# Altium schematic sheet top.SchDoc: CAN Shield k64F
size A; Author: Ramiro Merello; DrawnBy: Ramiro Merello; Revision: .revision; SheetNumber: 1; SheetTotal: 1
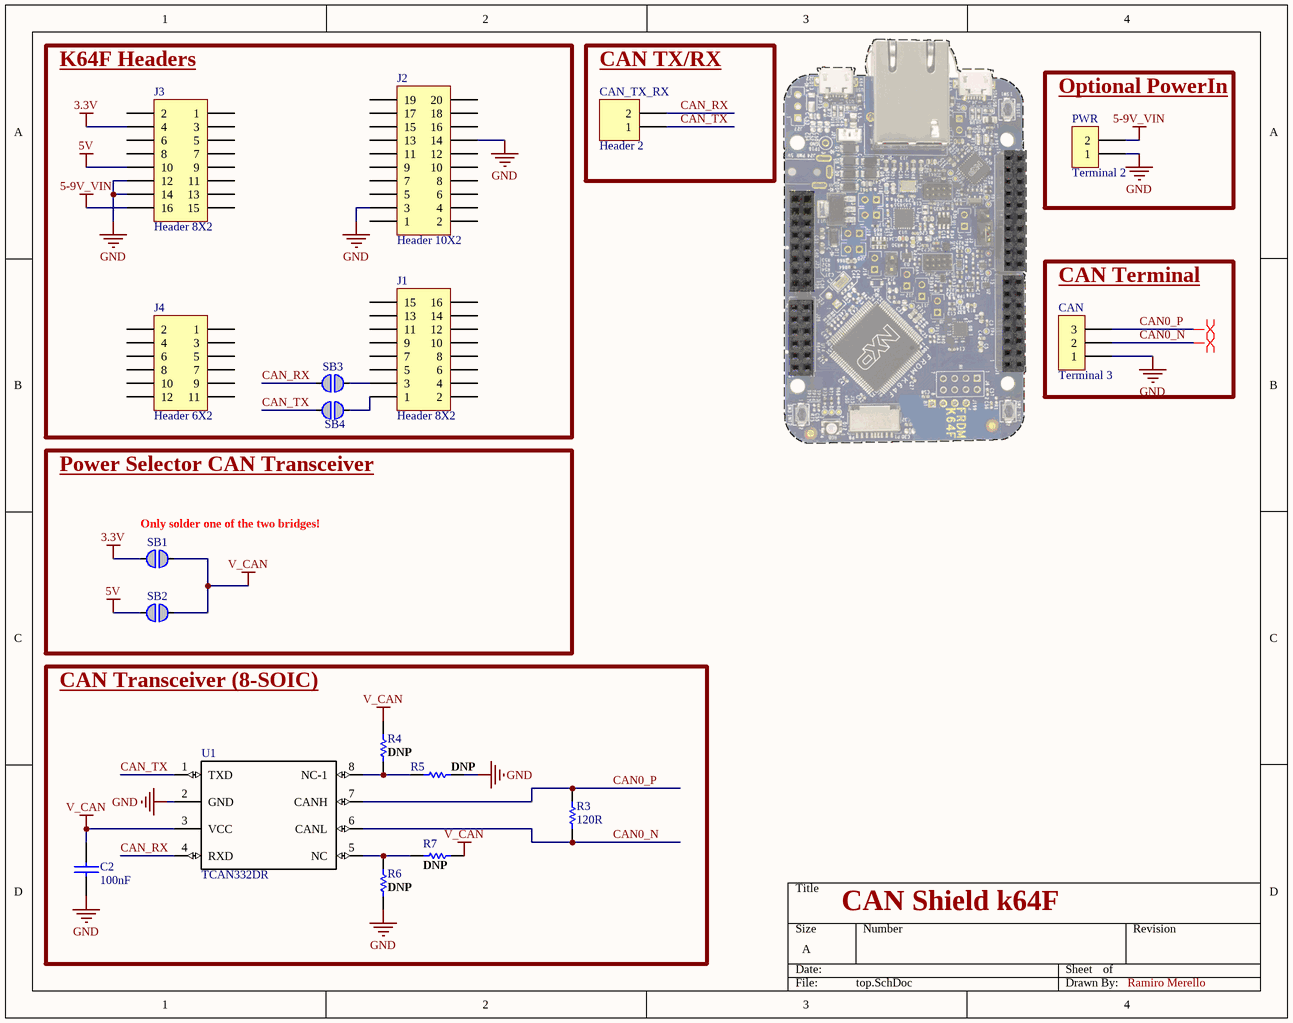
[diagram p0: top.SchDoc]

## Parts
C2  value 100nF  [0805]  (hidden comment: CDecoup)
CAN  Terminal 3  [BORNERA3]
CAN_TX_RX  Header 2  [HDR1X2]
J1  Header 8X2  [HDR2X8]
J2  Header 10X2  [HDR2X10]
J3  Header 8X2  [HDR2X8]
J4  Header 6X2  [HDR2X6]
PWR  Terminal 2  [BORNERA2]
R3  value 120R  [0805]  (hidden comment: RES)
R4  DNP  [0805]
R5  DNP  [0805]
R6  DNP  [0805]
R7  DNP  [0805]
SB1  Solderbridge  [Solderbridge]  (value not drawn)  (no BOM)
SB2  Solderbridge  [Solderbridge]  (value not drawn)  (no BOM)
SB3  Solderbridge  [Solderbridge]  (value not drawn)  (no BOM)
SB4  Solderbridge  [Solderbridge]  (value not drawn)  (no BOM)
U1  TCAN332DR  [SOIC127P600X175-8N]

## Blocks framed on the sheet
K64F Headers: J1-J4 SB3 SB4
CAN TX/RX: CAN_TX_RX
Optional PowerIn: PWR
CAN Terminal: CAN
Power Selector CAN Transceiver: SB1 SB2
CAN Transceiver (8-SOIC): C2 R3-R7 U1

## Nets
3.3V: J3.4 SB1.2
5-9V_VIN: J3.16 PWR.2
5V: J3.10 SB2.2
GND: C2.2 CAN.1 J2.3 J2.14 J3.12 J3.14 PWR.1 R5.2 R6.2 U1.2(GND)
V_CAN: C2.1 R4.1 R7.1 SB1.1 SB2.1 U1.3(VCC)
CAN0_N: CAN.2 R3.1 U1.6(CANL)
CAN0_P: CAN.3 R3.2 U1.7(CANH)
CAN_RX: CAN_TX_RX.2 SB3.2 U1.4(RXD)
CAN_TX: CAN_TX_RX.1 SB4.2 U1.1(TXD)
NetJ1_1: J1.1 SB4.1
NetJ1_3: J1.3 SB3.1
NetR4_2: R4.2 R5.1 U1.8(NC-1)
NetR6_1: R6.1 R7.2 U1.5(NC)

Not connected (* = marked no-connect by the designer): J1 2 4 5 6 7 8 9 10 11 12 13 14 15 16; J2 1 2 4 5 6 7 8 9 10 11 12 13 15 16 17 18 19 20; J3 1 2 3 5 6 7 8 9 11 13 15; J4 1 2 3 4 5 6 7 8 9 10 11 12

## Layout directives
differential pair; net class CAN0_D: CAN0_N, CAN0_P

## Notes on the sheet
- (near SB1) Only solder one of the two bridges!

## Library data of the parts
C2 = CAP
CAN = BORNERA 3
CAN_TX_RX = Header 2: Header, 2-Pin; LatestRevisionDate: 17-Jul-2002; LatestRevisionNote: Re-released for DXP Platform.; Publisher: Altium Limited
J1 J3 = Header 8X2: Header, 8-Pin, Dual row; LatestRevisionDate: 17-Jul-2002; LatestRevisionNote: Re-released for DXP Platform.; Publisher: Altium Limited
J2 = Header 10X2: Header, 10-Pin, Dual row; LatestRevisionDate: 17-Jul-2002; LatestRevisionNote: Re-released for DXP Platform.; Publisher: Altium Limited
J4 = Header 6X2: Header, 6-Pin, Dual row; LatestRevisionDate: 17-Jul-2002; LatestRevisionNote: Re-released for DXP Platform.; Publisher: Altium Limited
PWR = BORNERA 2
R4 = RES: Pullup
R5-R7 = RES
SB1-SB4 = SOLDERBRIDGE: Artikkelnr Noca: N.A.; Part Number: Solderbridge; Manufacturer: *; Manufacturer Part Number: *; Datasheet: *; LatestRevisionDate: 2009-12-14; Pin Count: 2; Publisher: Nordic Semiconductor; Published: 2009-12-14; Value: Solderbridge; Note: *; Supplier: *; Supplier part number: *; 2nd source Supplier: *; 2nd source part number: *; Footprint Doc: Solderbridge; Artikkelnr Simpro: N.A.
U1 = TCAN332DR: 3.3-V CAN Transceivers with CAN FD _Flexible Data Rate_ 8-SOIC -40 to 125; MF: Texas Instruments; Availability: Unavailable; MP: TCAN332DR; Price: None; Package: SOIC-8 Texas Instruments; SnapEDA_Link: https://www.snapeda.com/parts/TCAN332DR/Texas%20Instruments/view-part/?ref=snap; Value: *